# EAGLE design ECE_362_mini_project1 (EAGLE 7.5.0)
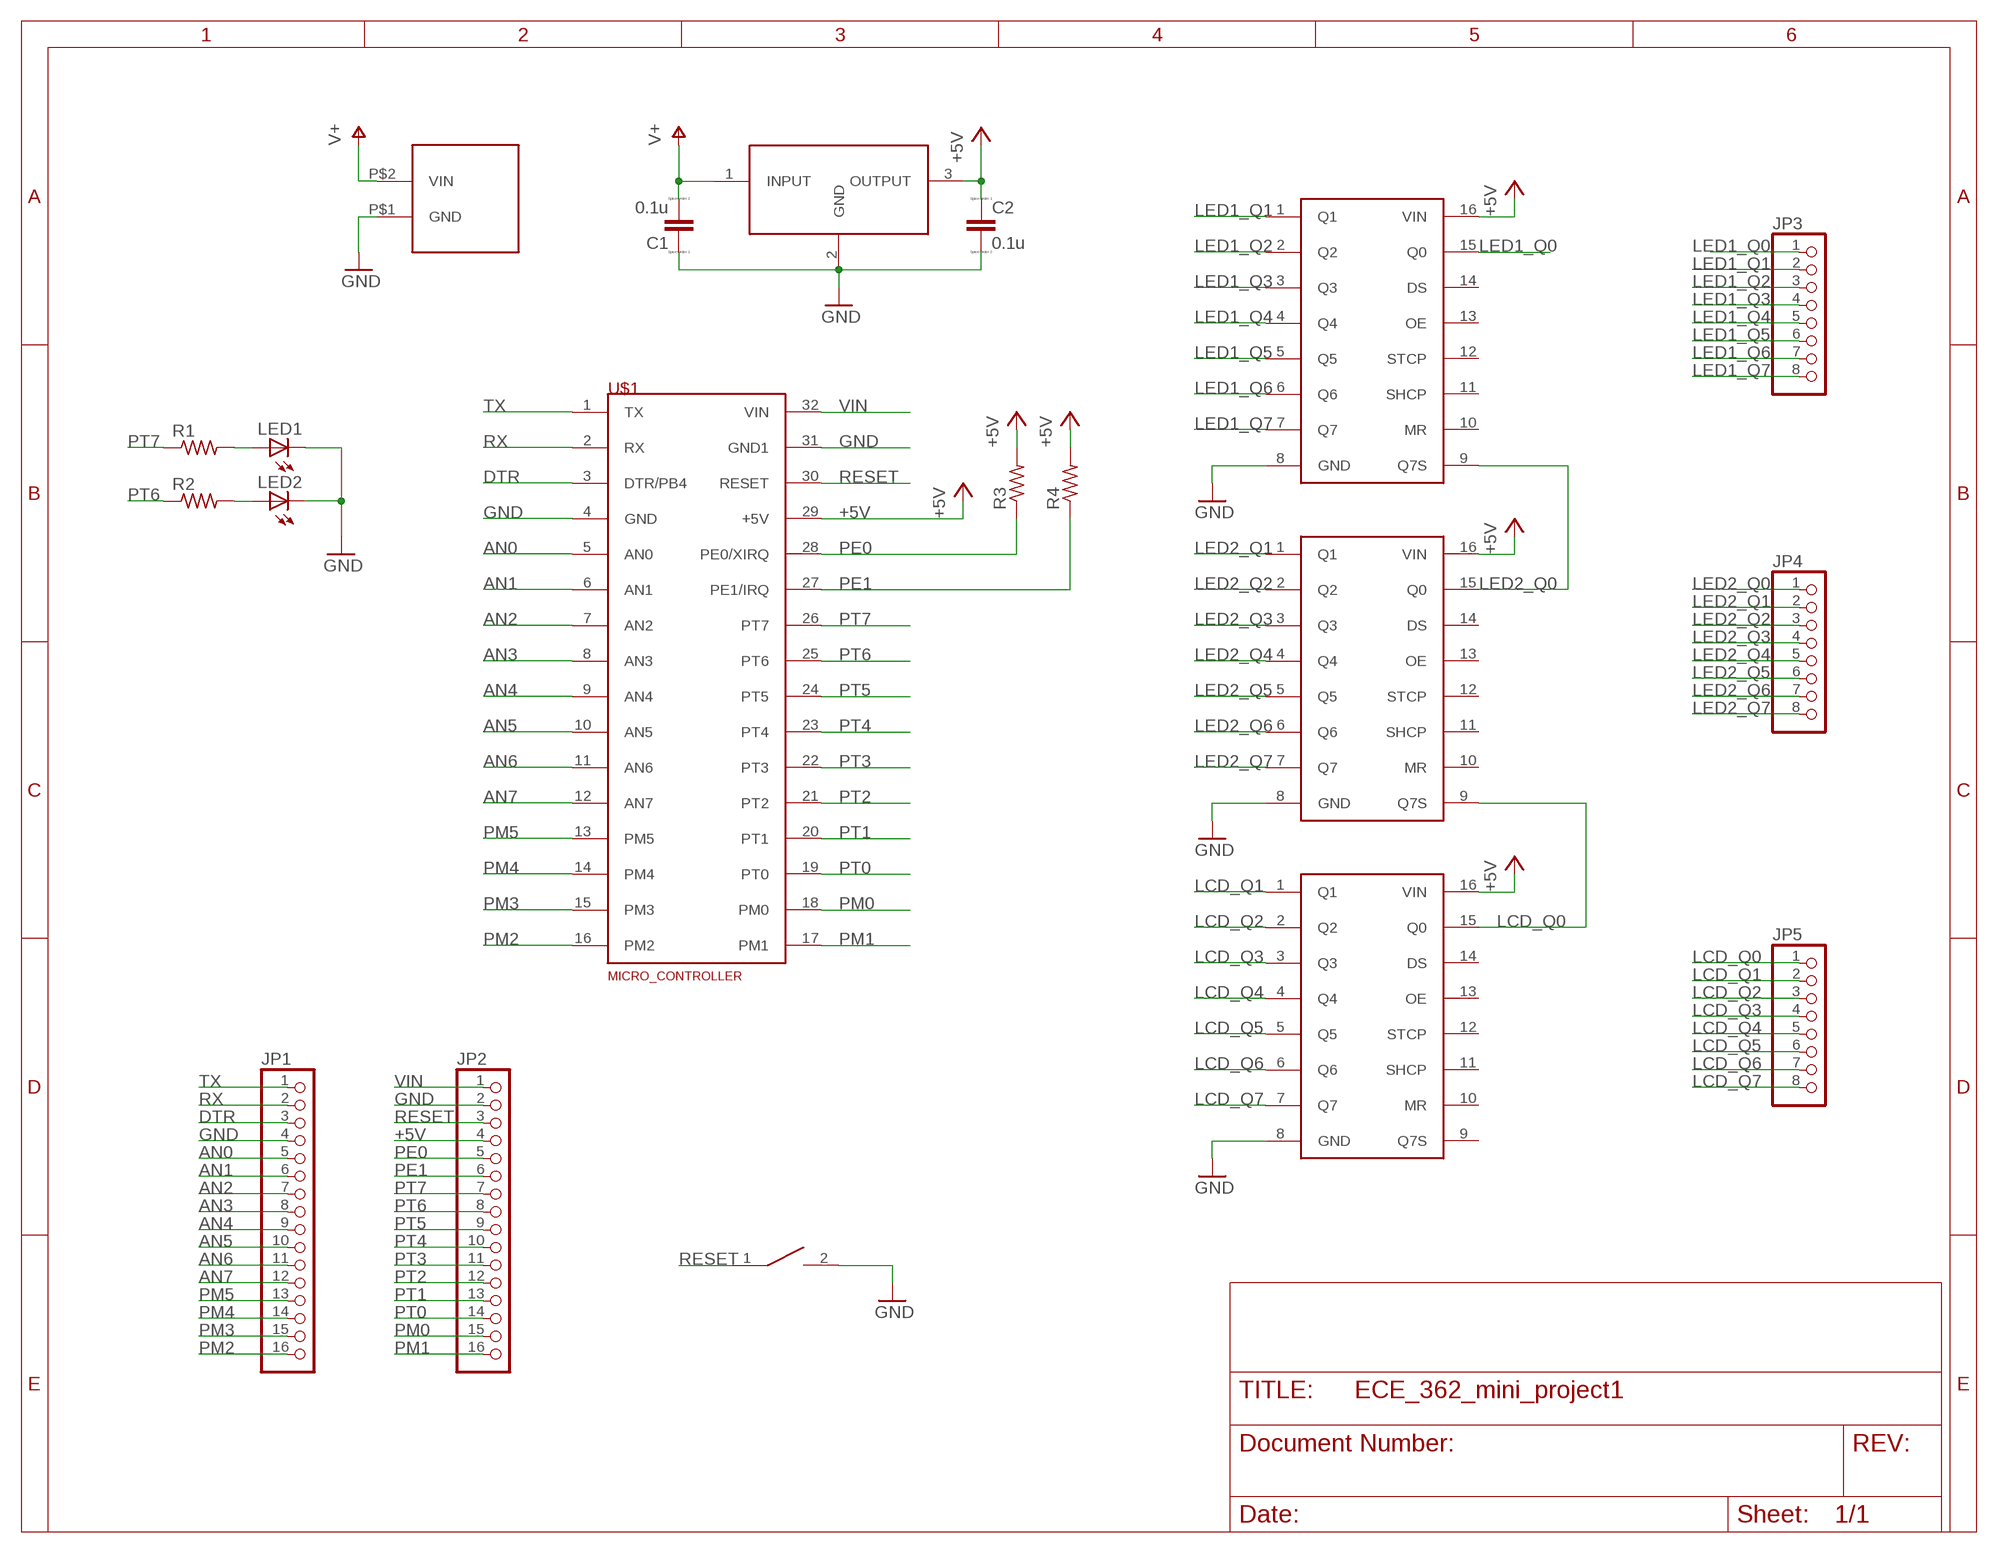
[diagram p0: schematic, sheet 1]

## Parts
BOOT_SW  SWITCH  [SW_2512]
C1  0.1u  CC0603  [C0603]
C2  0.1u  CC0603  [C0603]
JP1  PINHD-1X16  [1X16]
JP2  PINHD-1X16  [1X16]
JP3  PINHD-1X8  [1X08]
JP4  PINHD-1X8  [1X08]
JP5  PINHD-1X8  [1X08]
LED1  LEDCHIPLED_0603  [CHIPLED_0603]
LED2  LEDCHIPLED_0603  [CHIPLED_0603]
R1  R-US_R0603  [R0603]
R2  R-US_R0603  [R0603]
R3  R-US_R0603  [R0603]
R4  R-US_R0603  [R0603]
U$1  MICRO_CONTROLLER  [MICRO_CONTROLLER]
U$2  SHIFT_REGISTER  [N5]
U$3  XT60  [XT60]
U$4  SHIFT_REGISTER  [N5]
U$5  SHIFT_REGISTER  [N5]
U$6  L7805CV  [L7805CV]

## Nets
+5V: C2.1 JP2.4 R3.2 R4.2 U$1.29(+5V) U$2.16(VIN) U$4.16(VIN) U$5.16(VIN) U$6.3(OUTPUT)
AN0: JP1.5 U$1.5(AN0)
AN1: JP1.6 U$1.6(AN1)
AN2: JP1.7 U$1.7(AN2)
AN3: JP1.8 U$1.8(AN3)
AN4: JP1.9 U$1.9(AN4)
AN5: JP1.10 U$1.10(AN5)
AN6: JP1.11 U$1.11(AN6)
AN7: JP1.12 U$1.12(AN7)
DTR: JP1.3 U$1.3(DTR/PB4)
GND: BOOT_SW.2 C1.1 C2.2 JP1.4 JP2.2 LED1.C LED2.C U$1.4(GND) U$1.31(GND1) U$2.8(GND) U$3.P$1(GND) U$4.8(GND) U$5.8(GND) U$6.2(GND)
LCD_Q0: JP5.1 U$4.9(Q7S) U$5.15(Q0)
LCD_Q1: JP5.2 U$5.1(Q1)
LCD_Q2: JP5.3 U$5.2(Q2)
LCD_Q3: JP5.4 U$5.3(Q3)
LCD_Q4: JP5.5 U$5.4(Q4)
LCD_Q5: JP5.6 U$5.5(Q5)
LCD_Q6: JP5.7 U$5.6(Q6)
LCD_Q7: JP5.8 U$5.7(Q7)
LED1_Q0: JP3.1 U$2.15(Q0)
LED1_Q1: JP3.2 U$2.1(Q1)
LED1_Q2: JP3.3 U$2.2(Q2)
LED1_Q3: JP3.4 U$2.3(Q3)
LED1_Q4: JP3.5 U$2.4(Q4)
LED1_Q5: JP3.6 U$2.5(Q5)
LED1_Q6: JP3.7 U$2.6(Q6)
LED1_Q7: JP3.8 U$2.7(Q7)
LED2_Q0: JP4.1 U$2.9(Q7S) U$4.15(Q0)
LED2_Q1: JP4.2 U$4.1(Q1)
LED2_Q2: JP4.3 U$4.2(Q2)
LED2_Q3: JP4.4 U$4.3(Q3)
LED2_Q4: JP4.5 U$4.4(Q4)
LED2_Q5: JP4.6 U$4.5(Q5)
LED2_Q6: JP4.7 U$4.6(Q6)
LED2_Q7: JP4.8 U$4.7(Q7)
N$1: LED1.A R1.2
N$2: LED2.A R2.2
PE0: JP2.5 R3.1 U$1.28(PE0/XIRQ)
PE1: JP2.6 R4.1 U$1.27(PE1/IRQ)
PM0: JP2.15 U$1.18(PM0)
PM1: JP2.16 U$1.17(PM1)
PM2: JP1.16 U$1.16(PM2)
PM3: JP1.15 U$1.15(PM3)
PM4: JP1.14 U$1.14(PM4)
PM5: JP1.13 U$1.13(PM5)
PT0: JP2.14 U$1.19(PT0)
PT1: JP2.13 U$1.20(PT1)
PT2: JP2.12 U$1.21(PT2)
PT3: JP2.11 U$1.22(PT3)
PT4: JP2.10 U$1.23(PT4)
PT5: JP2.9 U$1.24(PT5)
PT6: JP2.8 R2.1 U$1.25(PT6)
PT7: JP2.7 R1.1 U$1.26(PT7)
RESET: BOOT_SW.1 JP2.3 U$1.30(RESET)
RX: JP1.2 U$1.2(RX)
TX: JP1.1 U$1.1(TX)
V+: C1.2 U$3.P$2(VIN) U$6.1(INPUT)
VIN: JP2.1 U$1.32(VIN)
Unconnected: U$2.10(MR) U$2.11(SHCP) U$2.12(STCP) U$2.13(OE) U$2.14(DS) U$4.10(MR) U$4.11(SHCP) U$4.12(STCP) U$4.13(OE) U$4.14(DS) U$5.9(Q7S) U$5.10(MR) U$5.11(SHCP) U$5.12(STCP) U$5.13(OE) U$5.14(DS)

## Library data of the parts
BOOT_SW = MicroBoard:SWITCH
C1 C2 = eagle-ltspice:C: CAPACITOR, European symbol; SPICEMODEL: NONE; SPICEPREFIX: C
JP1 JP2 = mini_project_parts:PINHD-1X16: PIN HEADER
JP3-JP5 = pinhead:PINHD-1X8: PIN HEADER
LED1 LED2 = led:LED: LED OSRAM: - CHIPLED LG R971, LG N971, LY N971, LG Q971, LY Q971, LO R971, LY R971 LH N974, LH R974 LS Q976, LO Q976, LY Q976 LO Q996 - Hyper CHIPLED LW Q18S LB Q993, LB Q99A, LB R99A - SideLED LS A670, LO A670, LY A670, LG A670, LP A670 LB A673, LV A673, LT A673, LW A673 LH A674 LY A675 LS A676, LA A676, LO A676, LY A676, LW A676 LS A679, LY A679, LG A679 - Hyper Micro SIDELED® LS Y876, LA Y876, LO Y876, LY Y876 LT Y87S - SmartLED LW L88C, LW L88S LB L89C, LB L89S, LG L890 LS L89K, LO L89K, LY L89K LS L896, LA L896, LO L896, LY L896 - TOPLED LS T670, LO T670, LY T670, LG T670, LP T670 LSG T670, LSP T670, LSY T670, LOP T670, LYG T670 LG T671, LOG T671, LSG T671 LB T673, LV T673, LT T673, LW T673 LH T674 LS T676, LA T676, LO T676, LY T676, LB T676, LH T676, LSB T676, LW T676 LB T67C, LV T67C, LT T67C, LS T67K, LO T67K, LY T67K, LW E67C LS E67B, LA E67B, LO E67B, LY E67B, LB E67C, LV E67C, LT E67C LW T67C LS T679, LY T679, LG T679 LS T770, LO T770, LY T770, LG T770, LP T770 LB T773, LV T773, LT T773, LW T773 LH T774 LS E675, LA E675, LY E675, LS T675 LS T776, LA T776, LO T776, LY T776, LB T776 LHGB T686 LT T68C, LB T68C - Hyper Mini TOPLED® LB M676 - Mini TOPLED Santana® LG M470 LS M47K, LO M47K, LY M47K Source: http://www.osram.convergy.de LUXEON: - LUMILED® LXK2-PW12-R00, LXK2-PW12-S00, LXK2-PW14-U00, LXK2-PW14-V00 LXK2-PM12-R00, LXK2-PM12-S00, LXK2-PM14-U00 LXK2-PE12-Q00, LXK2-PE12-R00, LXK2-PE12-S00, LXK2-PE14-T00, LXK2-PE14-U00 LXK2-PB12-K00, LXK2-PB12-L00, LXK2-PB12-M00, LXK2-PB14-N00, LXK2-PB14-P00, LXK2-PB14-Q00 LXK2-PR12-L00, LXK2-PR12-M00, LXK2-PR14-Q00, LXK2-PR14-R00 LXK2-PD12-Q00, LXK2-PD12-R00, LXK2-PD12-S00 LXK2-PH12-R00, LXK2-PH12-S00 LXK2-PL12-P00, LXK2-PL12-Q00, LXK2-PL12-R00 Source: www.luxeon.com KINGBRIGHT: KA-3528ASYC Source: www.kingbright.com
R1-R4 = resistor:R-US_: RESISTOR, American symbol
U$1 = mini_project_parts:MICRO_CONTROLLER
U$2 U$4 U$5 = mini_project_parts:SHIFT_REGISTER
U$3 = mini_project_parts:XT60
U$6 = mini_project_parts:L7805CV

## Board
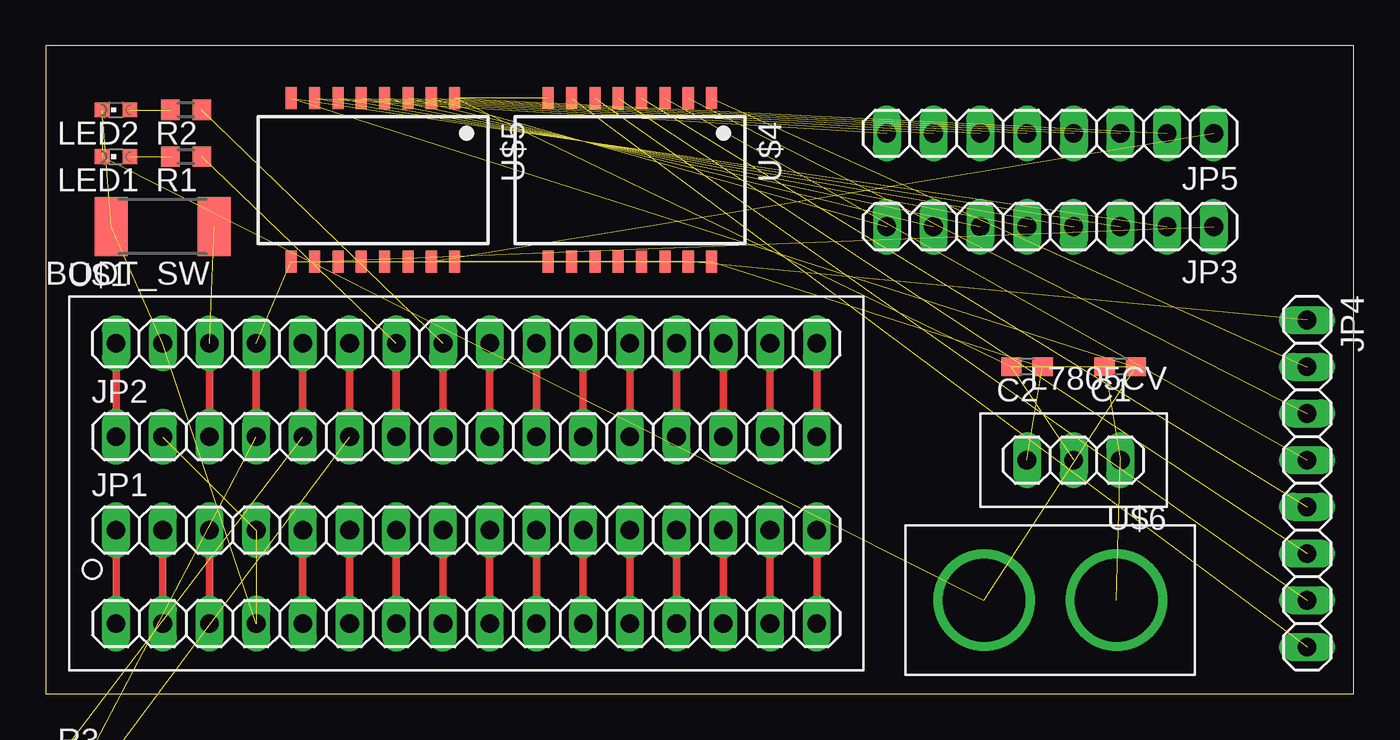
[diagram p1: board, top side]
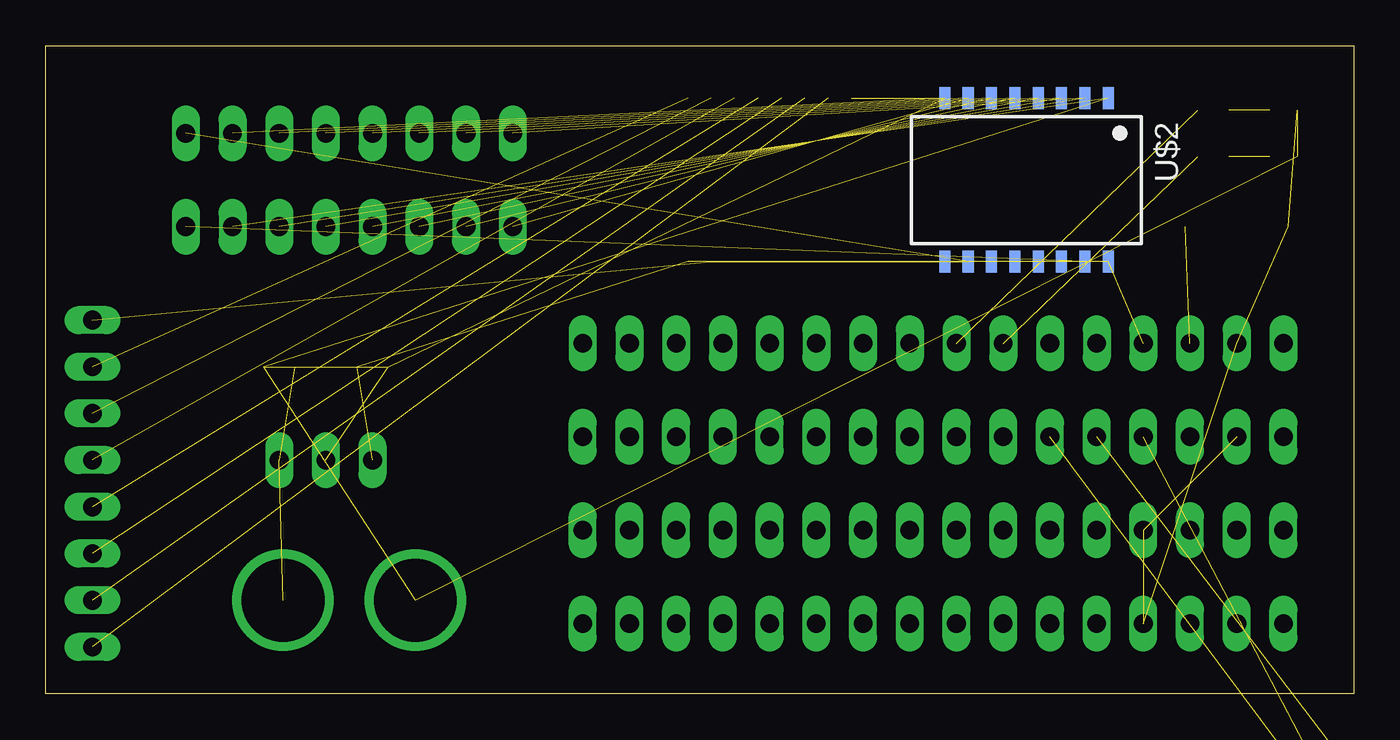
[diagram p2: board, bottom side, seen from below]

Size 71.1 x 35.23 mm. Coordinates in mm from the lower left corner, seen from the top.
Outline: 0,0 71.1,0 71.1,35.23 0,35.23 0,0
Copper layers (1*16): Top 0.035mm / dielectric 1.5mm / Bottom 0.035mm
Design rules "default": minimum track width 10mil, minimum drill 24mil, track to track 8mil, track to pad 8mil, pad to pad 8mil, via to via 8mil, smd to smd 8mil, copper to edge 40mil, drill to drill 8mil, minimum pad ring 10mil, minimum via ring 8mil, stop-mask expansion 4mil, vias tented up to drill 0mil, thermal gap 10mil

### Footprints (pad centres in the part's own frame; a part is rotated, then mirrored left to right if it is on the bottom)
SW_2512 = smd 1.8 x 3.2: 1 -2.8,0; 2 2.8,0
C0603 = smd 1.1 x 1: 1 -0.85,0; 2 0.85,0
1X16 = drill 1.016 long: 1 -19.05,0; 2 -16.51,0; 3 -13.97,0; 4 -11.43,0; 5 -8.89,0; 6 -6.35,0; 7 -3.81,0; 8 -1.27,0; 9 1.27,0; 10 3.81,0; 11 6.35,0; 12 8.89,0; 13 11.43,0; 14 13.97,0; 15 16.51,0; 16 19.05,0
1X08 = drill 1.016 long: 1 -8.89,0; 2 -6.35,0; 3 -3.81,0; 4 -1.27,0; 5 1.27,0; 6 3.81,0; 7 6.35,0; 8 8.89,0
CHIPLED_0603 = smd 0.8 x 0.8: A 0,-0.75; C 0,0.75
R0603 = smd 1 x 1.1: 1 -0.85,0; 2 0.85,0
MICRO_CONTROLLER = drill 1.016 long: 1 0,0; 2 2.54,0; 3 5.08,0; 4 7.62,0; 5 10.16,0; 6 12.7,0; 7 15.24,0; 8 17.78,0; 9 20.32,0; 10 22.86,0; 11 25.4,0; 12 27.94,0; 13 30.48,0; 14 33.02,0; 15 35.56,0; 16 38.1,0; 17 38.1,15.24; 18 35.56,15.24; 19 33.02,15.24; 20 30.48,15.24; 21 27.94,15.24; 22 25.4,15.24; 23 22.86,15.24; 24 20.32,15.24; 25 17.78,15.24; 26 15.24,15.24; 27 12.7,15.24; 28 10.16,15.24; 29 7.62,15.24; 30 5.08,15.24; 31 2.54,15.24; 32 0,15.24
N5 = smd 0.6 x 1.2: 1 -4.445,-4.445; 2 -3.175,-4.445; 3 -1.905,-4.445; 4 -0.635,-4.445; 5 0.635,-4.445; 6 1.905,-4.445; 7 3.175,-4.445; 8 4.445,-4.445; 9 4.445,4.445; 10 3.175,4.445; 11 1.905,4.445; 12 0.635,4.445; 13 -0.635,4.445; 14 -1.905,4.445; 15 -3.175,4.445; 16 -4.445,4.445
XT60 = drill 4.5 pad 5: P$1 0,3.6; P$2 0,-3.6
L7805CV = drill 1.016 long: 1 2.54,2.54; 2 5.08,2.54; 3 7.62,2.54

### Placement (x,y rotation side)
BOOT_SW  6.35,25.4 180 top
C1  58.42,17.78 180 top
C2  53.34,17.78 180 top
JP1  22.86,8.89 0 top
JP2  22.86,13.97 0 top
JP3  54.61,25.4 180 top
JP4  68.58,11.43 270 top
JP5  54.61,30.48 180 top
LED1  3.81,29.21 90 top
LED2  3.81,31.75 90 top
R1  7.62,29.21 180 top
R2  7.62,31.75 180 top
R3  1.27,-3.81 0 top  (outside the outline)
R4  1.27,-7.62 0 top  (outside the outline)
U$1  3.81,3.81 0 top
U$2  17.78,27.94 180 bottom
U$3  54.61,5.08 90 top
U$4  31.75,27.94 180 top
U$5  17.78,27.94 180 top
U$6  60.96,15.24 180 top

### Tracks (layer width: path | path; a pad name or v marks a point on that pad's centre or on a via)
+5V  (7 unrouted)
  Top 0.406: U$1.29 JP2.4
AN0
  Top 0.406: JP1.5 U$1.5
AN1
  Top 0.406: JP1.6 U$1.6
AN2
  Top 0.406: JP1.7 U$1.7
AN3
  Top 0.406: JP1.8 U$1.8
AN4
  Top 0.406: JP1.9 U$1.9
AN5
  Top 0.406: JP1.10 U$1.10
AN6
  Top 0.406: JP1.11 U$1.11
AN7
  Top 0.406: JP1.12 U$1.12
DTR
  Top 0.406: JP1.3 U$1.3
GND  (13 unrouted)
LCD_Q0  (2 unrouted)
LCD_Q1  (1 unrouted)
LCD_Q2  (1 unrouted)
LCD_Q3  (1 unrouted)
LCD_Q4  (1 unrouted)
LCD_Q5  (1 unrouted)
LCD_Q6  (1 unrouted)
LCD_Q7  (1 unrouted)
LED1_Q0  (1 unrouted)
LED1_Q1  (1 unrouted)
LED1_Q2  (1 unrouted)
LED1_Q3  (1 unrouted)
LED1_Q4  (1 unrouted)
LED1_Q5  (1 unrouted)
LED1_Q6  (1 unrouted)
LED1_Q7  (1 unrouted)
LED2_Q0  (2 unrouted)
LED2_Q1  (1 unrouted)
LED2_Q2  (1 unrouted)
LED2_Q3  (1 unrouted)
LED2_Q4  (1 unrouted)
LED2_Q5  (1 unrouted)
LED2_Q6  (1 unrouted)
LED2_Q7  (1 unrouted)
N$1  (1 unrouted)
N$2  (1 unrouted)
PE0  (1 unrouted)
  Top 0.406: U$1.28 JP2.5
PE1  (1 unrouted)
  Top 0.406: U$1.27 JP2.6
PM0
  Top 0.406: U$1.18 JP2.15
PM1
  Top 0.406: U$1.17 JP2.16
PM2
  Top 0.406: JP1.16 U$1.16
PM3
  Top 0.406: JP1.15 U$1.15
PM4
  Top 0.406: JP1.14 U$1.14
PM5
  Top 0.406: JP1.13 U$1.13
PT0
  Top 0.406: U$1.19 JP2.14
PT1
  Top 0.406: U$1.20 JP2.13
PT2
  Top 0.406: U$1.21 JP2.12
PT3
  Top 0.406: U$1.22 JP2.11
PT4
  Top 0.406: U$1.23 JP2.10
PT5
  Top 0.406: U$1.24 JP2.9
PT6  (1 unrouted)
  Top 0.406: U$1.25 JP2.8
PT7  (1 unrouted)
  Top 0.406: U$1.26 JP2.7
RESET  (1 unrouted)
  Top 0.406: U$1.30 JP2.3
RX
  Top 0.406: JP1.2 U$1.2
TX
  Top 0.406: JP1.1 U$1.1
V+  (2 unrouted)
VIN
  Top 0.406: U$1.32 JP2.1